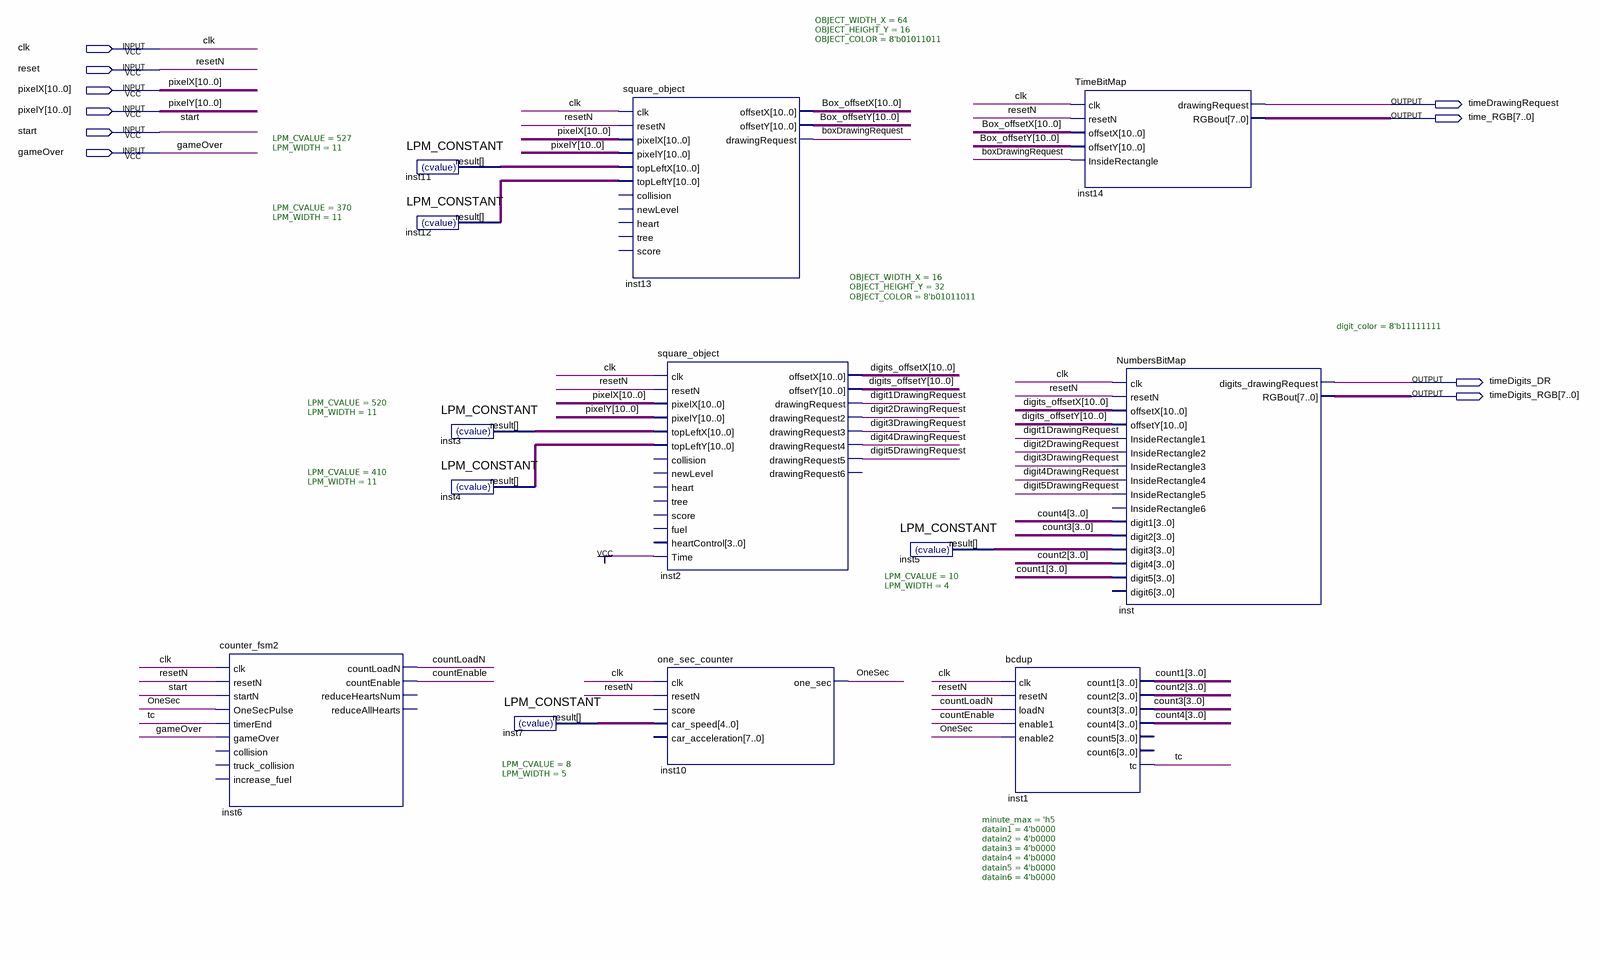
[diagram p0: schematic sheet]
// Quartus schematic Time_Block.bdf as structural Verilog: 13 symbols, 10 pins
module Time_Block (
  input  clk,
  input  reset,
  input  [10:0] pixelX,
  input  [10:0] pixelY,
  input  start,
  input  gameOver,
  output timeDrawingRequest,
  output [7:0] time_RGB,
  output timeDigits_DR,
  output [7:0] timeDigits_RGB
);

  wire boxDrawingRequest, countEnable, countLoadN, digit1DrawingRequest, digit2DrawingRequest,
       digit3DrawingRequest, digit4DrawingRequest, digit5DrawingRequest, OneSec, tc;
  wire [3:0] count1, count2, count3, count4, inst5_result;
  wire [4:0] inst7_result;
  wire [10:0] Box_offsetX, Box_offsetY, digits_offsetX, digits_offsetY, inst3_result, inst4_result,
       inst11_result, inst12_result;

  counter_fsm2 inst6 (
    .clk(clk), .resetN(reset), .startN(start), .OneSecPulse(OneSec), .timerEnd(tc), .gameOver(gameOver),
    .countLoadN(countLoadN), .countEnable(countEnable));  // open: collision, truck_collision, increase_fuel, reduceHeartsNum, reduceAllHearts
  LPM_CONSTANT #(.LPM_CVALUE(527), .LPM_WIDTH(11)) inst11 (.result(inst11_result));
  LPM_CONSTANT #(.LPM_CVALUE(370), .LPM_WIDTH(11)) inst12 (.result(inst12_result));
  LPM_CONSTANT #(.LPM_CVALUE(520), .LPM_WIDTH(11)) inst3 (.result(inst3_result));
  LPM_CONSTANT #(.LPM_CVALUE(410), .LPM_WIDTH(11)) inst4 (.result(inst4_result));
  LPM_CONSTANT #(.LPM_CVALUE(8), .LPM_WIDTH(5)) inst7 (.result(inst7_result));
  square_object #(.OBJECT_WIDTH_X(64), .OBJECT_HEIGHT_Y(16), .OBJECT_COLOR(8'b01011011)) inst13 (
    .clk(clk), .resetN(reset), .pixelX(pixelX), .pixelY(pixelY), .topLeftX(inst11_result),
    .topLeftY(inst12_result), .offsetX(Box_offsetX), .offsetY(Box_offsetY), .drawingRequest(boxDrawingRequest));  // open: collision, newLevel, heart, tree, score
  square_object #(.OBJECT_WIDTH_X(16), .OBJECT_HEIGHT_Y(32), .OBJECT_COLOR(8'b01011011)) inst2 (
    .clk(clk), .resetN(reset), .pixelX(pixelX), .pixelY(pixelY), .topLeftX(inst3_result),
    .topLeftY(inst4_result), .Time(1'b1), .offsetX(digits_offsetX), .offsetY(digits_offsetY),
    .drawingRequest(digit1DrawingRequest), .drawingRequest2(digit2DrawingRequest),
    .drawingRequest3(digit3DrawingRequest), .drawingRequest4(digit4DrawingRequest),
    .drawingRequest5(digit5DrawingRequest));  // open: collision, newLevel, heart, tree, score, fuel, heartControl, drawingRequest6
  one_sec_counter inst10 (
    .clk(clk), .resetN(reset), .car_speed(inst7_result), .one_sec(OneSec));  // open: score, car_acceleration
  LPM_CONSTANT #(.LPM_CVALUE(10), .LPM_WIDTH(4)) inst5 (.result(inst5_result));
  bcdup #(.minute_max('h5), .datain1(4'b0000), .datain2(4'b0000), .datain3(4'b0000), .datain4(4'b0000), .datain5(4'b0000), .datain6(4'b0000)) inst1 (
    .clk(clk), .resetN(reset), .loadN(countLoadN), .enable1(countEnable), .enable2(OneSec), .count1(count1),
    .count2(count2), .count3(count3), .count4(count4), .tc(tc));  // open: count5, count6
  TimeBitMap inst14 (
    .clk(clk), .resetN(reset), .offsetX(Box_offsetX), .offsetY(Box_offsetY),
    .InsideRectangle(boxDrawingRequest), .drawingRequest(timeDrawingRequest), .RGBout(time_RGB));
  NumbersBitMap #(.digit_color(8'b11111111)) inst (
    .clk(clk), .resetN(reset), .offsetX(digits_offsetX), .offsetY(digits_offsetY),
    .InsideRectangle1(digit1DrawingRequest), .InsideRectangle2(digit2DrawingRequest),
    .InsideRectangle3(digit3DrawingRequest), .InsideRectangle4(digit4DrawingRequest),
    .InsideRectangle5(digit5DrawingRequest), .digit1(count4), .digit2(count3), .digit3(inst5_result),
    .digit4(count2), .digit5(count1), .digits_drawingRequest(timeDigits_DR), .RGBout(timeDigits_RGB));  // open: InsideRectangle6, digit6

  // Other names for the same wires on the sheet: resetN = reset
endmodule
